# EAGLE design Solar_FeatherWing_02 (EAGLE 7.7.0)
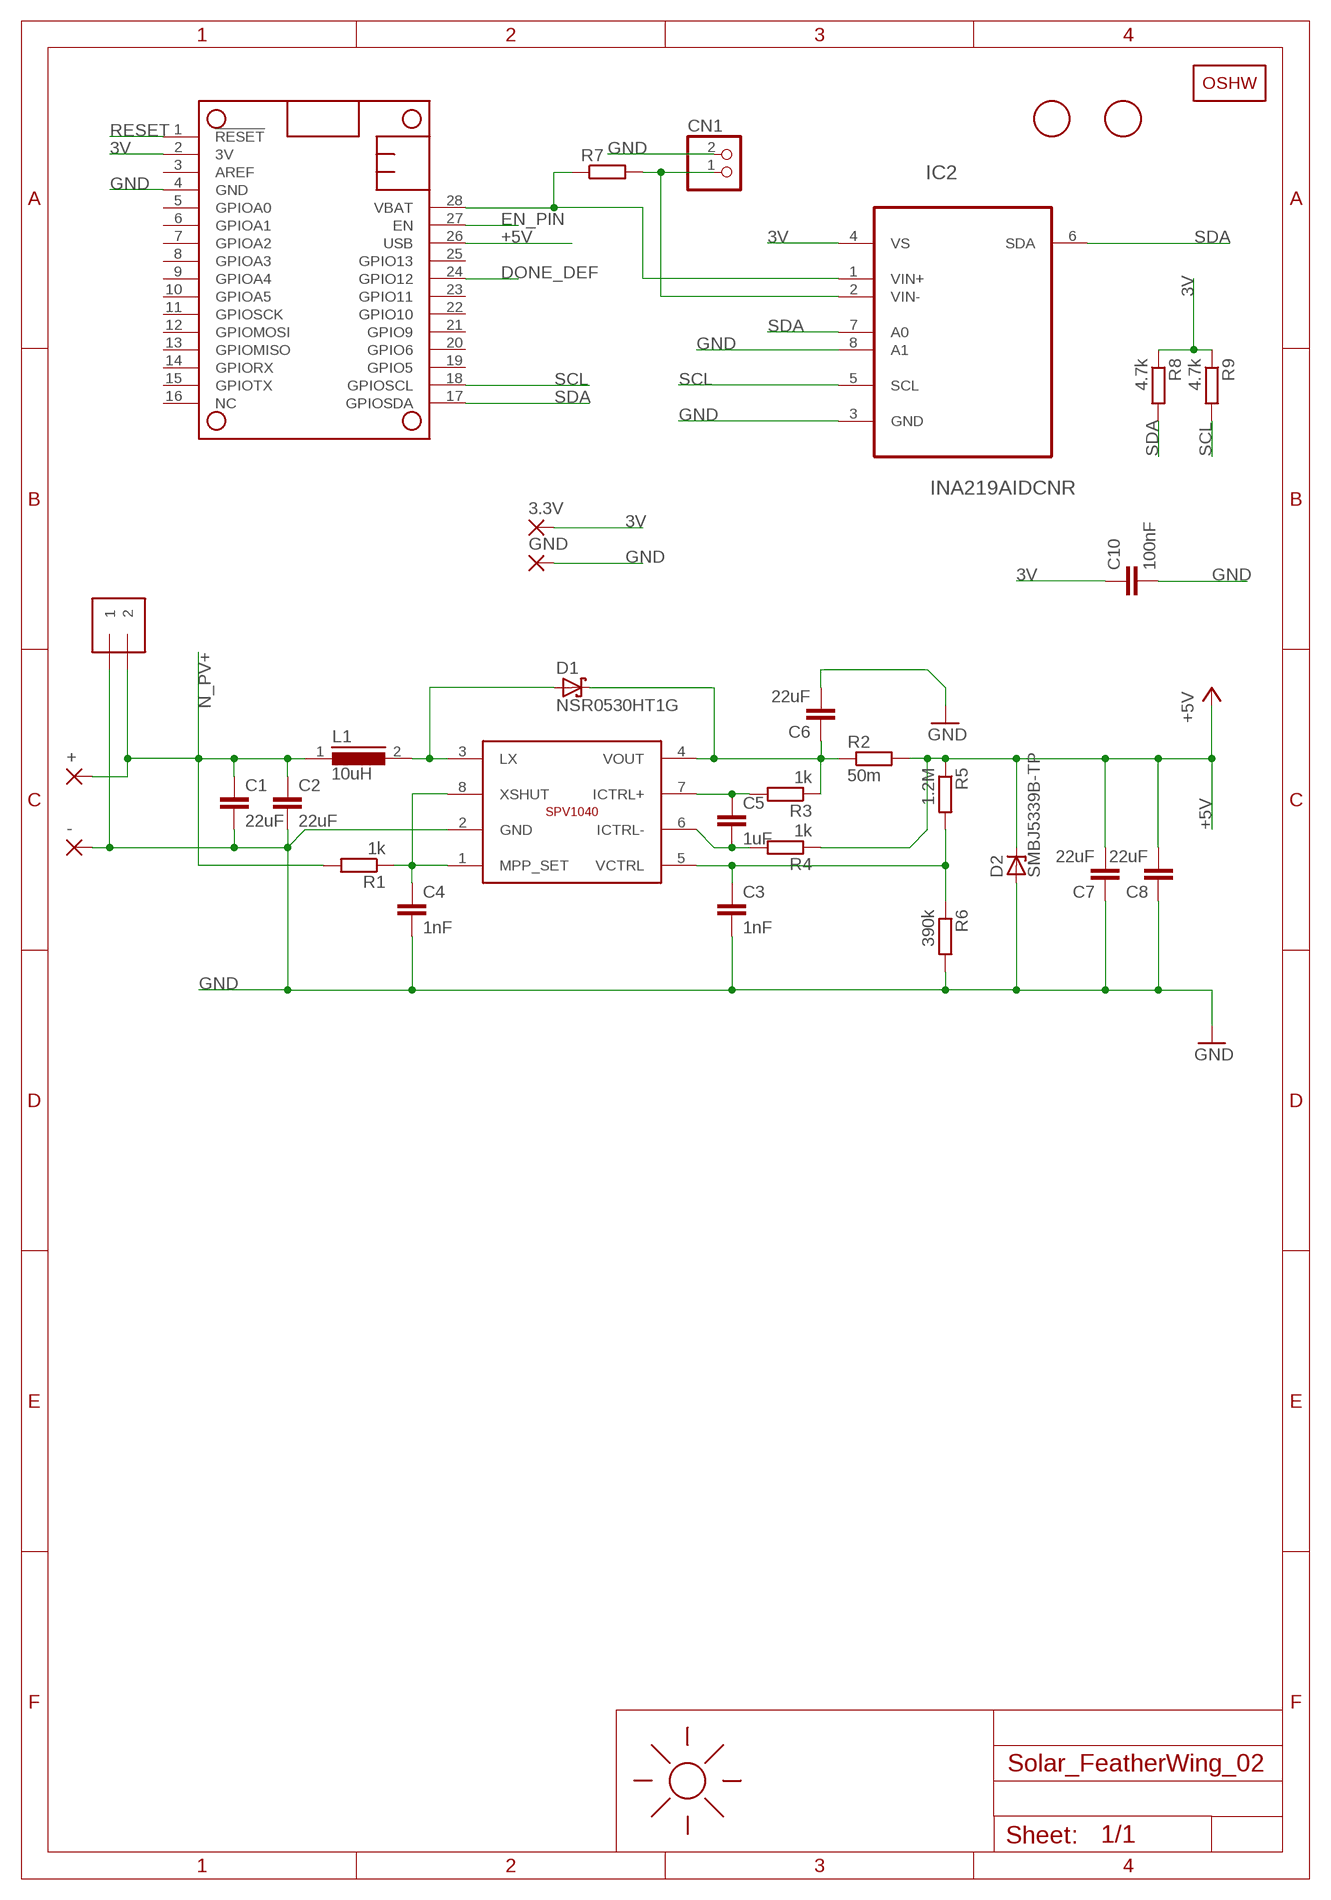
[diagram p0: schematic, sheet 1]

## Parts
3.3V  1,6/0,9  [1,6/0,9]
+  1,6/0,9  [1,6/0,9]
-  1,6/0,9  [1,6/0,9]
C1  22uF  C-EUC0603K  [C0603K]
C2  22uF  C-EUC0603K  [C0603K]
C3  1nF  C-EUC0603K  [C0603K]
C4  1nF  C-EUC0603K  [C0603K]
C5  1uF  C-EUC0603K  [C0603K]
C6  22uF  C-EUC0603K  [C0603K]
C7  22uF  C-EUC0603K  [C0603K]
C8  22uF  C-EUC0603K  [C0603K]
C10  100nF  C-EUC0603K  [C0603K]
CN1  JST_2PIN-SMT-RA  [JST-PH-2-SMT-RA]
D1  NSR0530HT1G  BAT60J  [SOD323_ST]
D2  SMBJ5339B-TP  ZENER-DIODESMB  [SMB]
GND  1,6/0,9  [1,6/0,9]
IC1  SPV1040T  [TSSOP8]
IC2  INA219AIDCNR  [SOT65P280X145-8N]
J1  1X2-3.5MM  [1X2-3.5MM]
L1  10uH  DR74  [DR74]
LOGO1  OSHW_LOGOX0100  [OSHW_6X100]
MS1  FEATHERWING  [FEATHERWING]
R1  1k  R-EU_R0603  [R0603]
R2  50m  R-EU_R0603  [R0603]
R3  1k  R-EU_R0603  [R0603]
R4  1k  R-EU_R0603  [R0603]
R5  1.2M  R-EU_R0603  [R0603]
R6  390k  R-EU_R0603  [R0603]
R7  R-EU_R1206  [R1206]
R8  4.7k  R-EU_R0603  [R0603]
R9  4.7k  R-EU_R0603  [R0603]
U$1  SUNLOGO  [SUN]
U$2  FIDUCIAL  [FIDUCIAL_1MM]
U$3  FIDUCIAL  [FIDUCIAL_1MM]

## Nets
3V: 3.3V.1(P) C10.1 IC2.4(VS) MS1.2(3V) R8.1 R9.1
+5V: C7.2 C8.2 D2.C MS1.26(USB) R2.2 R4.1 R5.1
DONE_DEF: MS1.24(GPIO12)
EN_PIN: MS1.27(EN)
GND: -.1(P) C1.2 C2.2 C3.2 C4.2 C6.2 C7.1 C8.1 C10.2 CN1.2 D2.A GND.1(P) IC1.2(GND) IC2.3(GND) IC2.8(A1) J1.1 MS1.4(GND) R6.2
LX: D1.A IC1.3(LX) L1.2
N$3: C4.1 IC1.1(MPP_SET) IC1.8(XSHUT) R1.1
N$4: C5.1 IC1.7(ICTRL+) R3.2
N$5: C5.2 IC1.6(ICTRL-) R4.2
N$7: C6.1 D1.C IC1.4(VOUT) R2.1 R3.1
N$15: CN1.1 IC2.2(VIN-) R7.2
N_PV+: +.1(P) C1.1 C2.1 J1.2 L1.1 R1.2
N_VCTRL: C3.1 IC1.5(VCTRL) R5.2 R6.1
RESET: MS1.1(!RESET)
SCL: IC2.5(SCL) MS1.18(GPIOSCL) R9.2
SDA: IC2.6(SDA) IC2.7(A0) MS1.17(GPIOSDA) R8.2
VBAT: IC2.1(VIN+) MS1.28(VBAT) R7.1
Unconnected: MS1.3(AREF) MS1.5(GPIOA0) MS1.6(GPIOA1) MS1.7(GPIOA2) MS1.8(GPIOA3) MS1.9(GPIOA4) MS1.10(GPIOA5) MS1.11(GPIOSCK) MS1.12(GPIOMOSI) MS1.13(GPIOMISO) MS1.14(GPIORX) MS1.15(GPIOTX) MS1.16(NC) MS1.19(GPIO5) MS1.20(GPIO6) MS1.21(GPIO9) MS1.22(GPIO10) MS1.23(GPIO11) MS1.25(GPIO13)

## Library data of the parts
3.3V + - GND = wirepad:1,6/0,9: THROUGH-HOLE PAD
C1-C8 C10 = rcl:C-EU: CAPACITOR, European symbol
CN1 = adafruit:JST_2PIN: JST 2-Pin Connectors of various flavors SMT-RA (S2B-PH-SM4) 4UConnector #17311 SMT (B2B-PH-SM4) THM-RA (S2B-PH) THM (B2B-PH)
D1 = diode:BAT60J: Schottky barrier diode Source: www.st.com, BAT60J.pdf
D2 = diode:ZENER-DIODE: Z-Diode
IC1 = SPV1040:SPV1040T
IC2 = Texas Instruments_By_element14_Batch_1:INA219AIDCNR: CURRENT/POWER MONITOR; MPN: INA219AIDCNR; OC_FARNELL: 1682558; OC_NEWARK: 09P2546; PACKAGE: SOT-23-8; SUPPLIER: Texas Instruments
J1 = adafruit:1X2: 3.5mm Terminal block http://www.ladyada.net/library/pcb/eaglelibrary.html
L1 = inductors:DR74: High Power Density, High Efficiency, Shielded Inductors Source: coiltronics_dr_series.pdf
LOGO1 = we-symbol:OSHW_LOGO: Open-Source-Hardware Logo
MS1 = adafruit:FEATHERWING
R1-R9 = rcl:R-EU_: RESISTOR, European symbol
U$1 = adafruit:SUNLOGO: Just a SMT logo of a sun. cute!
U$2 U$3 = adafruit:FIDUCIAL: For use by pick and place machines to calibrate the vision/machine, 1mm By microbuilder.eu

## Board
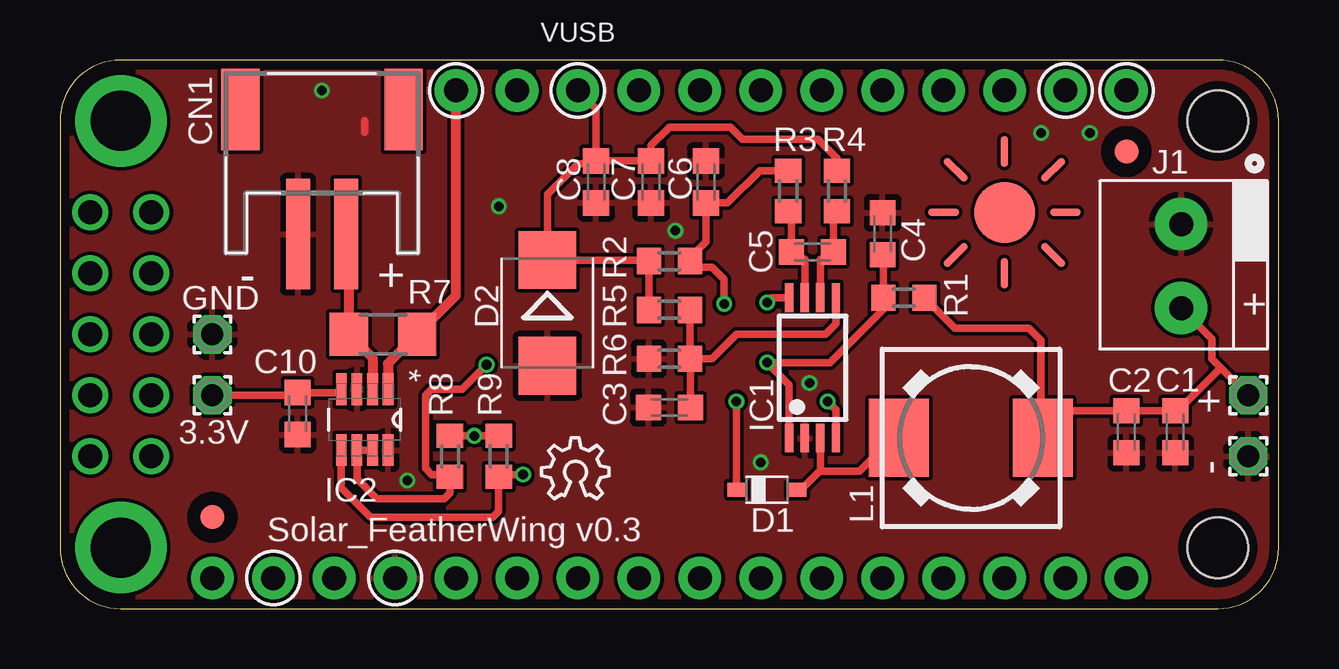
[diagram p1: board, top side]
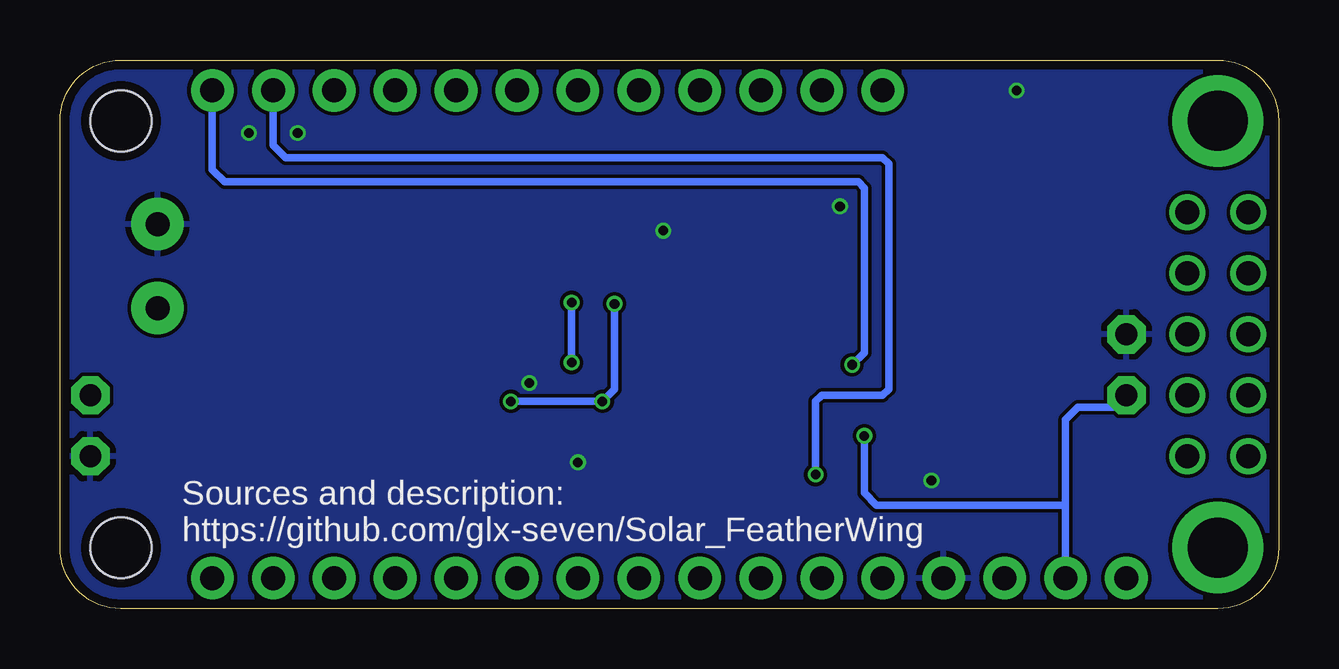
[diagram p2: board, bottom side, seen from below]

Size 50.8 x 22.86 mm. Coordinates in mm from the lower left corner, seen from the top.
Copper layers (1*16): Top 0.035559375mm / dielectric 1.6mm / Bottom 0.035559375mm
Design rules "oshpark-2layer *": minimum track width 6mil, minimum drill 10mil, track to track 6mil, track to pad 6mil, pad to pad 6mil, via to via 6mil, smd to smd 6mil, copper to edge 15mil, drill to drill 6mil, minimum pad ring 5mil, minimum via ring 5mil, stop-mask expansion 2.5mil, vias tented up to drill 17mil, thermal gap 10mil

### Footprints (pad centres in the part's own frame; a part is rotated, then mirrored left to right if it is on the bottom)
1,6/0,9 = drill 0.914 pad 1.6 octagon: 1 0,0
C0603K = smd 1.05 x 1.08: 1 -0.875,0; 2 0.875,0
JST-PH-2-SMT-RA = smd 1 x 4.6: 1 1,-3.7; 2 -1,-3.7 | smd 1.6 x 3.4: NC1 -3.4,1.5; NC2 3.4,1.5
SOD323_ST = smd 0.8 x 0.6: A 1.25,0; C -1.25,0
SMB = smd 2.4 x 2.4: A 2.2,0; C -2.2,0
TSSOP8 = smd 1.2 x 0.35: 1 -2.925,0.975; 2 -2.925,0.325; 3 -2.925,-0.325; 4 -2.925,-0.975; 5 2.925,-0.975; 6 2.925,-0.325; 7 2.925,0.325; 8 2.925,0.975
SOT65P280X145-8N = smd 1.321 x 0.45: 1 -1.27,0.975; 2 -1.27,0.325; 3 -1.27,-0.325; 4 -1.27,-0.975; 5 1.27,-0.975; 6 1.27,-0.325; 7 1.27,0.325; 8 1.27,0.975
1X2-3.5MM = drill 1 pad 2.184: 1 1.8,0; 2 -1.7,0
DR74 = smd 2.5 x 3.25: 1 -3,0; 2 3,0
FEATHERWING = drill 1 pad 1.778: 1 6.35,1.27; 2 8.89,1.27; 3 11.43,1.27; 4 13.97,1.27; 5 16.51,1.27; 6 19.05,1.27; 7 21.59,1.27; 8 24.13,1.27; 9 26.67,1.27; 10 29.21,1.27; 11 31.75,1.27; 12 34.29,1.27; 13 36.83,1.27; 14 39.37,1.27; 15 41.91,1.27; 16 44.45,1.27; 17 44.45,21.59; 18 41.91,21.59; 19 39.37,21.59; 20 36.83,21.59; 21 34.29,21.59; 22 31.75,21.59; 23 29.21,21.59; 24 26.67,21.59; 25 24.13,21.59; 26 21.59,21.59; 27 19.05,21.59; 28 16.51,21.59 | drill 2.5 pad 3.81: P$1 2.54,20.32; P$2 2.54,2.54 | hole 2.54: 48.26,20.32; 48.26,2.54
R0603 = smd 1 x 1.1: 1 -0.85,0; 2 0.85,0
R1206 = smd 1.6 x 1.803: 1 -1.422,0; 2 1.422,0
SUN = smd 2.54 x 2.54: P$1 0,0 | smd 0.305 x 1.27: P$2 0,2.54; P$3 0,-2.54 | smd 1.27 x 0.305: P$4 2.54,0; P$5 -2.54,0 | smd 1.27 x 0.305 rotated 45: P$6 2.032,1.778 | smd 1.27 x 0.305 rotated 135: P$7 2.032,-1.778 | smd 1.27 x 0.305 rotated 225: P$8 -2.032,-1.778 | smd 1.27 x 0.305 rotated 315: P$9 -2.032,1.778
FIDUCIAL_1MM = smd 1 x 1: 1 0,0

### Placement (x,y rotation side)
3.3V  6.35,8.89 180 top
+  49.53,8.89 90 top
-  49.53,6.35 90 top
C1  46.48,7.37 270 top
C2  44.45,7.37 270 top
C3  25.4,8.38 180 top
C4  34.29,15.62 90 top
C5  31.37,14.86 0 top
C6  26.92,17.78 90 top
C7  24.64,17.78 90 top
C8  22.35,17.78 90 top
C10  9.91,8.13 270 top
CN1  10.92,19.3 0 top
D1  29.46,4.95 0 top
D2  20.32,12.32 270 top
GND  6.35,11.43 180 top
IC1  31.37,10.03 90 top
IC2  12.7,7.87 270 top
J1  46.74,14.22 90 top
L1  37.97,7.11 180 top
LOGO1  20.07,4.57 0 top
MS1  0,0 0 top
R1  35.18,12.95 0 top
R2  25.4,14.48 180 top
R3  30.35,17.4 270 top
R4  32.38,17.4 270 top
R5  25.4,12.45 0 top
R6  25.4,10.41 180 top
R7  13.46,11.43 180 top
R8  16.26,6.35 270 top
R9  18.29,6.35 270 top
U$1  39.37,16.51 0 top
U$2  6.35,3.81 0 top
U$3  44.45,19.05 0 top

### Tracks (layer width: path | path; a pad name or v marks a point on that pad's centre or on a via)
3V  (via drill 0.4)
  Top 0.305: IC2.4 11.58,9 C10.1 9.79,8.89 3.3V.1 | R8.1 v17.27,7.2 R9.1
  Bottom 0.305: 8.89,4.32 16.76,4.32 17.27,4.83 v17.27,7.2 | 8.89,4.32 8.89,7.87 8.38,8.38 6.6,8.38 6.35,8.64 3.3V.1 | 8.89,4.32 MS1.2
+5V
  Top 0.305: C8.2 C7.2 24.64,19.3 25.4,20.07 27.94,20.07 28.45,19.56 31.58,19.56 32.38,18.76 R4.1 | D2.C 20.32,17.27 21.59,18.54 22.75,18.54 C8.2 | R2.2 24.51,14.52 20.83,14.52 | 20.83,14.52 D2.C | R2.2 24.64,14.48 | R2.2 R5.1 | D2.C 20.11,14.73 | 20.53,14.22 20.83,14.52 | C8.2 22.35,20.83 MS1.26
GND  (via drill 0.4)
  Top 0.305: 12.7,20.32 12.7,19.85
  other vias: 40.89,19.81 31.24,9.4 25.65,15.75 29.21,6.1 42.93,19.81 18.29,16.76 10.92,21.59 14.48,5.33
  pour Top: 0,0 50.8,0 50.8,22.86 0,22.86
  pour Bottom: 0,0 50.8,0 50.8,22.86 0,22.86
LX
  Top 0.305: IC1.3 31.69,5.77 | 31.69,5.77 31.75,5.71 33.32,5.71 34.72,7.11 L1.2 | 31.69,5.77 30.88,4.95 D1.A
N$1  (via drill 1 pad 1.42)
  other vias: 1.27,11.43
N$2  (via drill 1 pad 1.42)
  other vias: 1.27,13.97
N$3  (via drill 0.4)
  Top 0.305: IC1.8 29.67,12.96 v29.47,12.76 | C4.1 34.33,14.96 R1.1 34.33,12.48 32.1,10.25 v29.47,10.25 30.39,9.33 IC1.1
  Bottom 0.305: v29.47,12.76 v29.47,10.25
N$4
  Top 0.305: IC1.7 31.04,14.56 C5.1 30.49,16.15 R3.2
N$5
  Top 0.305: IC1.6 31.69,14.56 C5.2 32.24,16.41 R4.2
N$6  (via drill 1 pad 1.42)
  other vias: 1.27,16.51
N$7  (via drill 0.4)
  Top 0.305: v28.19,8.64 28.19,4.97 D1.C | IC1.4 32.34,8.3 v32,8.64 | R2.1 26.18,14.55 26.92,15.3 C6.1 27.83,16.91 29.17,18.25 R3.1 | R2.1 26.16,14.48 | v27.69,12.7 27.69,13.72 27.18,14.22 26.5,14.22 R2.1
  Bottom 0.305: v32,8.64 v28.19,8.64 27.69,9.14 v27.69,12.7
N$8  (via drill 1 pad 1.42)
  other vias: 1.27,8.89
N$9  (via drill 1 pad 1.42)
  other vias: 1.27,6.35
N$10  (via drill 1 pad 1.42)
  other vias: 3.81,6.35
N$11  (via drill 1 pad 1.42)
  other vias: 3.81,8.89
N$12  (via drill 1 pad 1.42)
  other vias: 3.81,11.43
N$13  (via drill 1 pad 1.42)
  other vias: 3.81,13.97
N$14  (via drill 1 pad 1.42)
  other vias: 3.81,16.51
N$15
  Top 0.406: IC2.2 13.03,10.45 R7.2 12.04,15.49 CN1.1
N_PV+
  Top 0.305: C1.1 C2.1 42.1,8.24 L1.1 | C1.1 46.74,8.49 46.85,8.49 48.39,10.03 | +.1 48.39,10.03 | 48.39,10.03 48.01,10.41 48.01,11.25 J1.2 | 46.59,8.13 C1.1 | 41.48,6.6 L1.1 | L1.1 40.89,7.19 40.89,11.18 40.39,11.68 37.3,11.68 R1.2
N_VCTRL
  Top 0.305: IC1.5 32.34,11.88 31.9,11.43 28.19,11.43 27.18,10.41 R6.1 | R5.2 R6.1 | C3.1 26.27,10.39 R6.1
SCL  (via drill 0.4)
  Top 0.305: IC2.5 11.72,5.04 12.95,3.81 18.03,3.81 18.29,4.06 R9.2 18.38,5.59 v19.3,5.59
  Bottom 0.305: MS1.18 41.91,19.3 41.4,18.8 16.51,18.8 16.26,18.54 16.26,9.14 16.51,8.89 19.05,8.89 19.3,8.64 v19.3,5.59
SDA  (via drill 0.4)
  Top 0.305: IC2.7 IC2.6 12.38,5.41 13.21,4.57 16,4.57 16.26,4.83 R8.2 16.17,5.59 15.49,5.59 15.24,5.84 15.24,8.89 15.49,9.14 16.76,9.14 v17.78,10.16
  Bottom 0.305: MS1.17 44.45,18.29 43.94,17.78 17.53,17.78 17.27,17.53 17.27,10.67 v17.78,10.16
VBAT
  Top 0.406: IC2.1 13.68,10.22 R7.1 16.51,13.06 MS1.28

### Text on the board
tPlace: VUSB | + | Solar_FeatherWing v0.3
bPlace: Sources and description: / https://github.com/glx-seven/Solar_FeatherWing